# Altium schematic sheet servos.SchDoc
size A4; DocumentNumber: 5; SheetNumber: 5; SheetTotal: 9
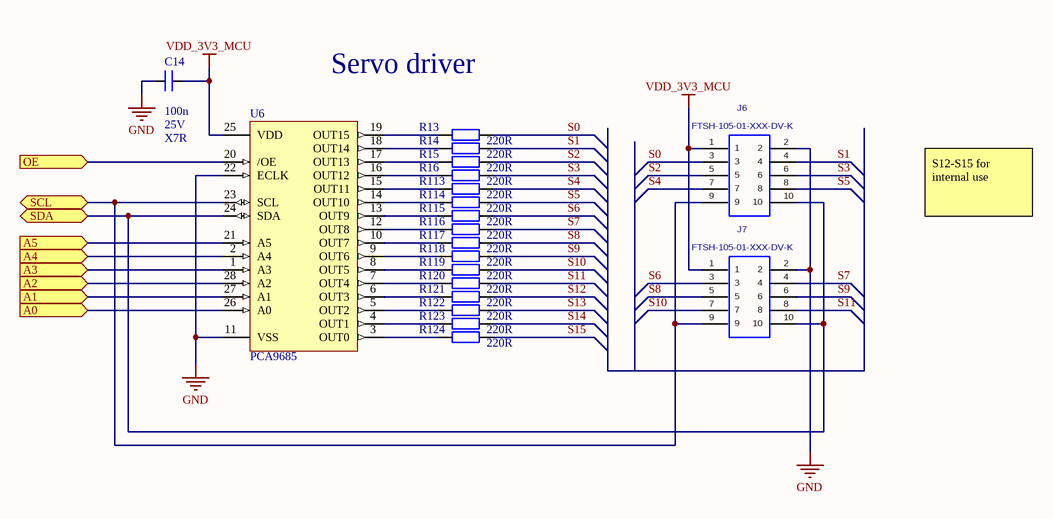
[diagram p0: servos.SchDoc]

## Parts
C14  value 100n  Voltage: 25V  Type: X7R  [C1005[0402]]  (hidden comment: cap)
J6  FTSH-105-01-XXX-DV-K  [FTSH-105-01-XXX-DV-K]
J7  FTSH-105-01-XXX-DV-K  [FTSH-105-01-XXX-DV-K]
R13  value 220R  [R1005[0402]]  (hidden comment: res)
R14  value 220R  [R1005[0402]]  (hidden comment: res)
R15  value 220R  [R1005[0402]]  (hidden comment: res)
R16  value 220R  [R1005[0402]]  (hidden comment: res)
R113  value 220R  [R1005[0402]]  (hidden comment: res)
R114  value 220R  [R1005[0402]]  (hidden comment: res)
R115  value 220R  [R1005[0402]]  (hidden comment: res)
R116  value 220R  [R1005[0402]]  (hidden comment: res)
R117  value 220R  [R1005[0402]]  (hidden comment: res)
R118  value 220R  [R1005[0402]]  (hidden comment: res)
R119  value 220R  [R1005[0402]]  (hidden comment: res)
R120  value 220R  [R1005[0402]]  (hidden comment: res)
R121  value 220R  [R1005[0402]]  (hidden comment: res)
R122  value 220R  [R1005[0402]]  (hidden comment: res)
R123  value 220R  [R1005[0402]]  (hidden comment: res)
R124  value 220R  [R1005[0402]]  (hidden comment: res)
U6  PCA9685  [NXP_QFN65P600X600X100_HS-29M]

## Ports
A0 (in), A1 (in), A2 (in), A3 (in), A4 (in), A5 (in), OE (in), SCL (bidir), SDA (bidir)

## Nets
GND: C14.1 J6.2 J7.2 U6.11(VSS) U6.22(ECLK)
VDD_3V3_MCU: C14.2 J6.1 J7.1 U6.25(VDD)
A0: U6.26(A0) ; port A0
A1: U6.27(A1) ; port A1
A2: U6.28(A2) ; port A2
A3: U6.1(A3) ; port A3
A4: U6.2(A4) ; port A4
A5: U6.21(A5) ; port A5
OE: U6.20(/OE) ; port OE
S0: J6.3 R13.2
S1: J6.4 R14.2
S2: J6.5 R15.2
S3: J6.6 R16.2
S4: J6.7 R113.2
S5: J6.8 R114.2
S6: J7.3 R115.2
S7: J7.4 R116.2
S8: J7.5 R117.2
S9: J7.6 R118.2
S10: J7.7 R119.2
S11: J7.8 R120.2
S12: R121.2
S13: R122.2
S14: R123.2
S15: R124.2
SCL: J6.9 J7.9 U6.23(SCL) ; port SCL
SDA: J6.10 J7.10 U6.24(SDA) ; port SDA
NetR13_1: R13.1 U6.19(OUT15)
NetR14_1: R14.1 U6.18(OUT14)
NetR15_1: R15.1 U6.17(OUT13)
NetR16_1: R16.1 U6.16(OUT12)
NetR113_1: R113.1 U6.15(OUT11)
NetR114_1: R114.1 U6.14(OUT10)
NetR115_1: R115.1 U6.13(OUT9)
NetR116_1: R116.1 U6.12(OUT8)
NetR117_1: R117.1 U6.10(OUT7)
NetR118_1: R118.1 U6.9(OUT6)
NetR119_1: R119.1 U6.8(OUT5)
NetR120_1: R120.1 U6.7(OUT4)
NetR121_1: R121.1 U6.6(OUT3)
NetR122_1: R122.1 U6.5(OUT2)
NetR123_1: R123.1 U6.4(OUT1)
NetR124_1: R124.1 U6.3(OUT0)

## Notes on the sheet
- Servo driver
- S12-S15 for internal use
- Title
- Size:
- Date:
- A4
- Number:
- Time:
- Revision:
- Sheet
- of
- File:

## Library data of the parts
C14 = cap: Capacitor; Manufacturer: *; Series: *
J6 J7 = FTSH-105-01-XXX-DV-K: TERMINAL STRIP, .050"(1.27mm) PITCH, 10 PINS, KEYED; MANUFACTURER: SAMTEC; CREATED: November 30, 2016 - Wendy Xin; PCB DECAL: FTSH-105-01-XXX-DV-K
R13-R16 R113-R124 = res: Resistor; Tolerance: 5%